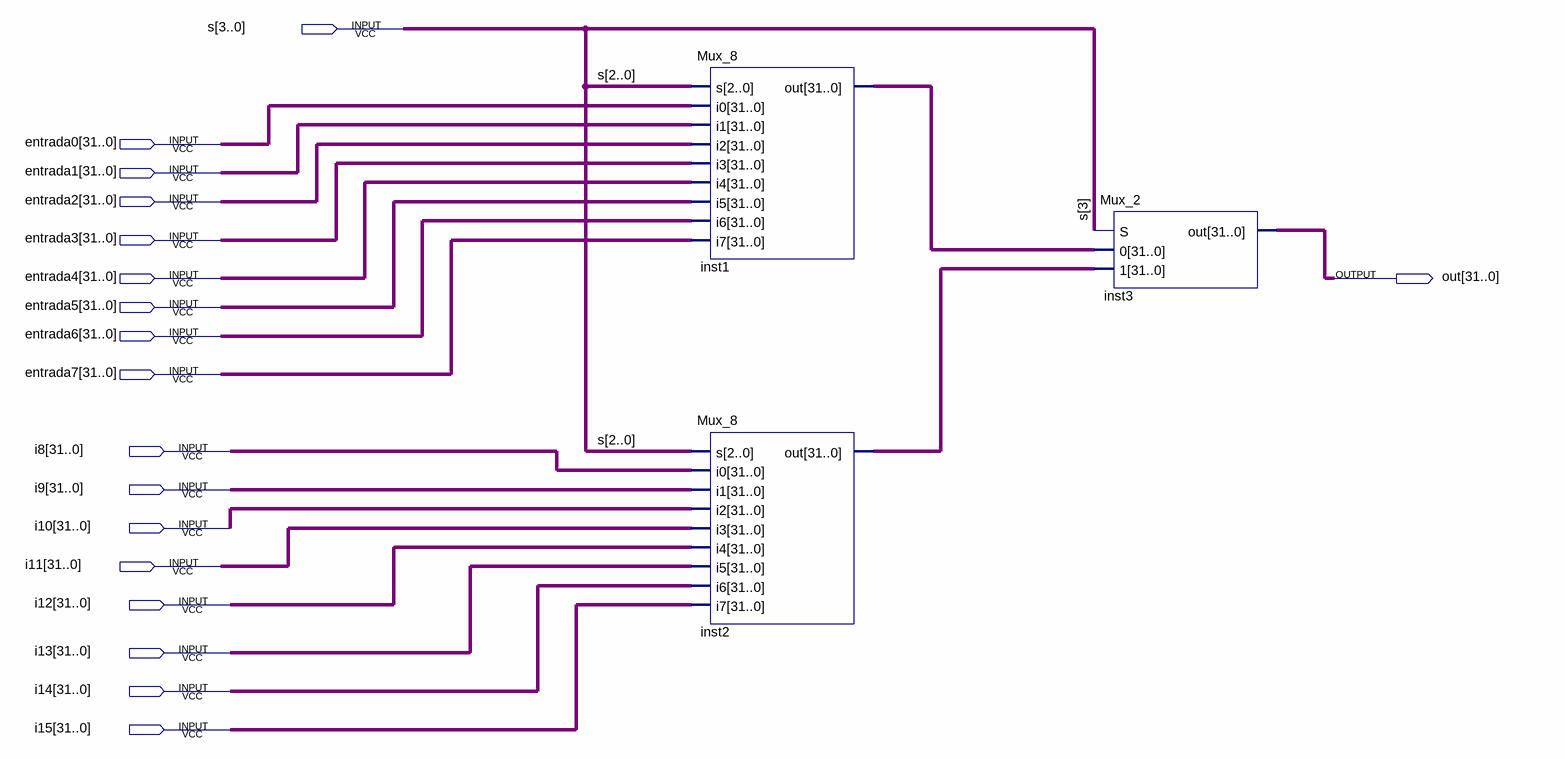
[diagram p0: schematic sheet]
// Quartus schematic Mux_16.bdf as structural Verilog: 3 symbols, 18 pins
module Mux_16 (
  input  [3:0] s,
  input  [31:0] entrada0,
  input  [31:0] entrada1,
  input  [31:0] entrada2,
  input  [31:0] entrada3,
  input  [31:0] entrada4,
  input  [31:0] entrada5,
  input  [31:0] entrada6,
  input  [31:0] entrada7,
  input  [31:0] i8,
  input  [31:0] i9,
  input  [31:0] i10,
  input  [31:0] i11,
  input  [31:0] i12,
  input  [31:0] i13,
  input  [31:0] i14,
  input  [31:0] i15,
  output [31:0] out
);

  wire [31:0] inst1_out, inst2_out;

  Mux_8 inst1 (
    .s(s[2:0]), .i0(entrada0), .i1(entrada1), .i2(entrada2), .i3(entrada3), .i4(entrada4), .i5(entrada5),
    .i6(entrada6), .i7(entrada7), .out(inst1_out));
  Mux_8 inst2 (
    .s(s[2:0]), .i0(i8), .i1(i9), .i2(i10), .i3(i11), .i4(i12), .i5(i13), .i6(i14), .i7(i15), .out(inst2_out));
  Mux_2 inst3 (.S(s[3]), .\0 (inst1_out), .\1 (inst2_out), .out(out));
endmodule
